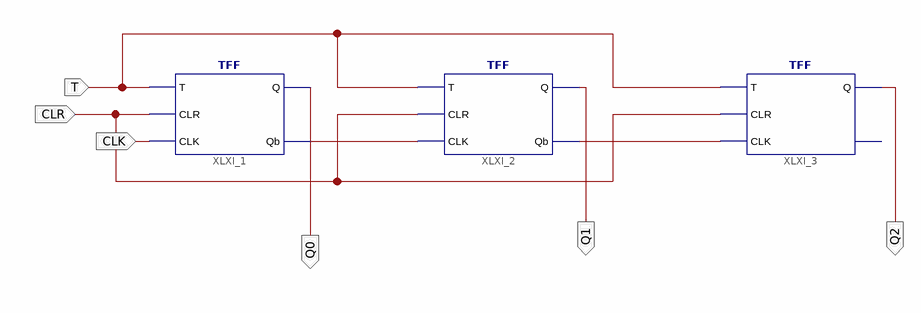
[diagram p0: schematic sheet 1]
// Xilinx ISE schematic Bit_3_asyn_down_counter.sch (spartan3a) as structural Verilog: 3 symbols, 6 ports
module Bit_3_asyn_down_counter (
  input  T,
  input  CLR,
  input  CLK,
  output Q0,
  output Q1,
  output Q2
);

  wire XLXN_3, XLXN_4;

  TFF XLXI_1 (.T(T), .CLR(CLR), .CLK(CLK), .Q(Q0), .Qb(XLXN_3));
  TFF XLXI_2 (.T(T), .CLR(CLR), .CLK(XLXN_3), .Q(Q1), .Qb(XLXN_4));
  TFF XLXI_3 (.T(T), .CLR(CLR), .CLK(XLXN_4), .Q(Q2));  // open: Qb
endmodule
